# Altium schematic sheet SimPL_IMU_v1_1 _NOV5.SchDoc
size 299 x 236 mm
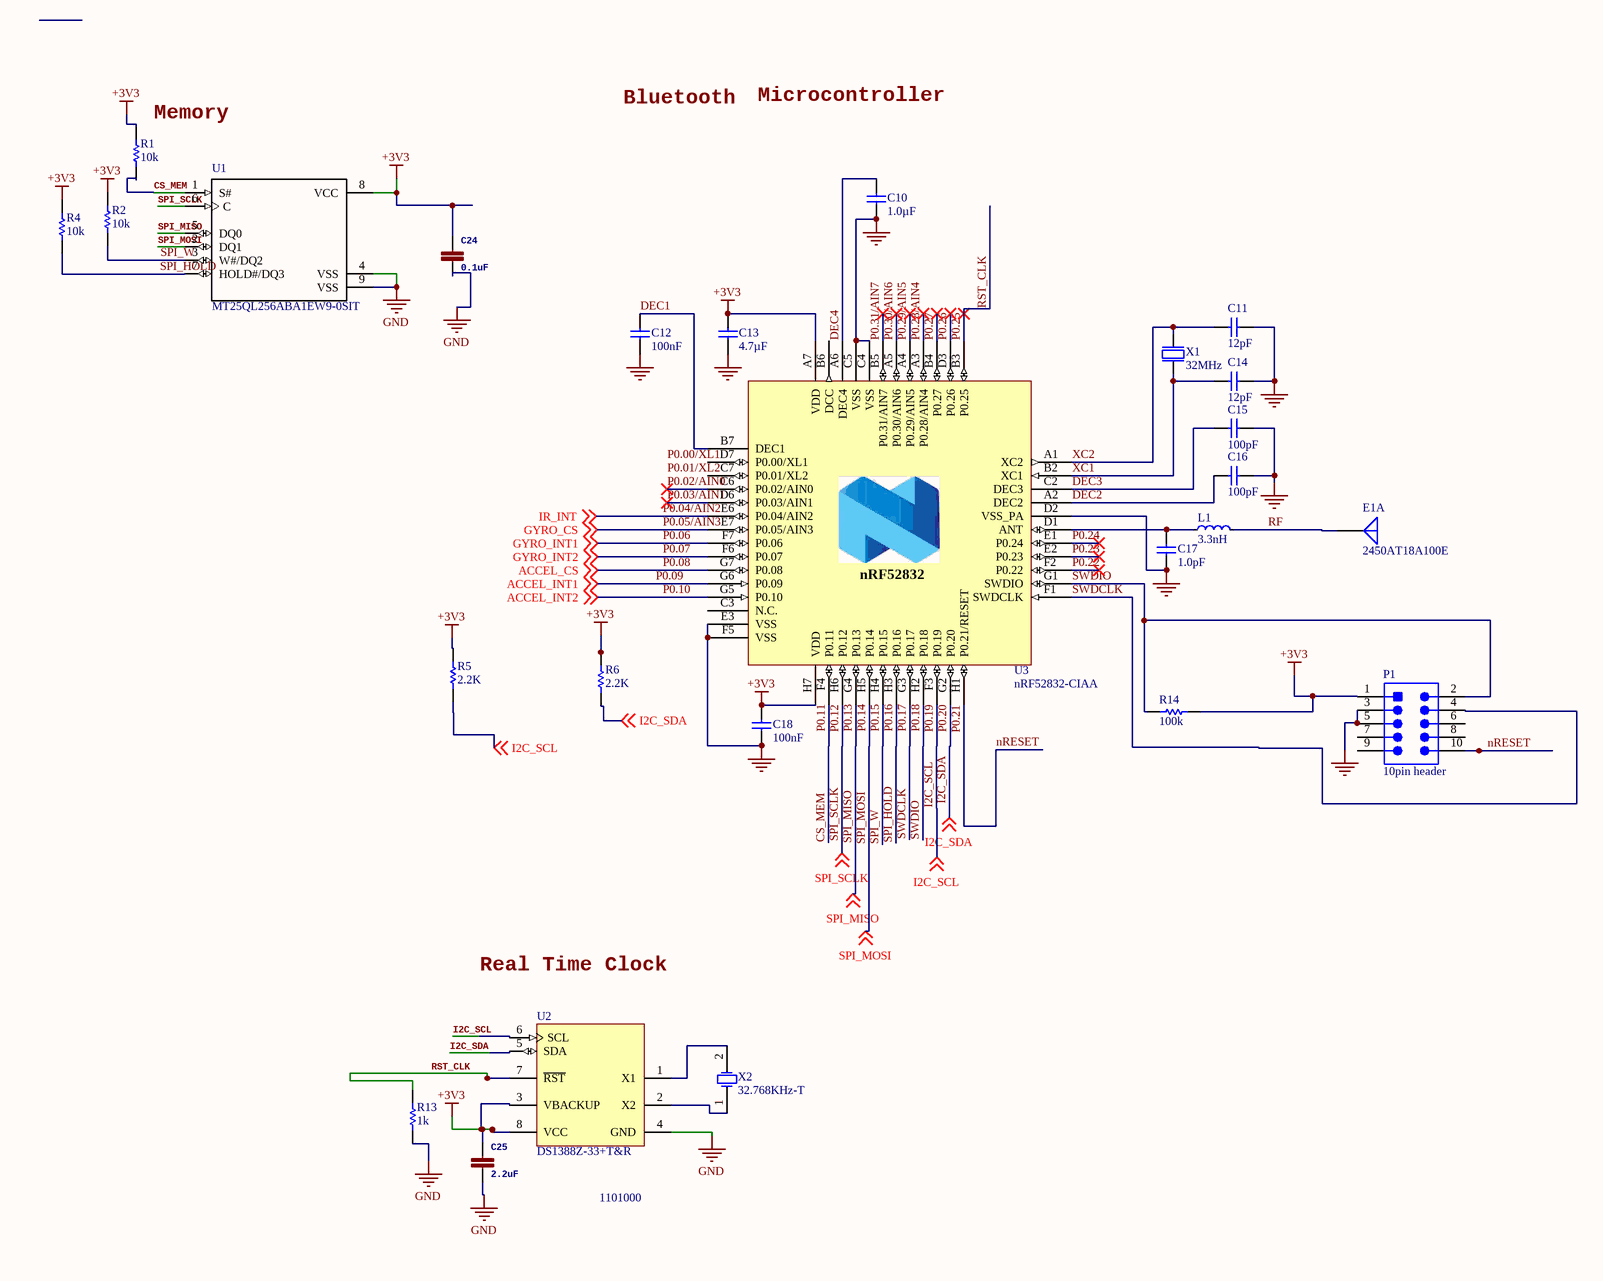
[diagram p0: SimPL_IMU_v1_1 _NOV5.SchDoc]

## Parts
C10  1.0µF  [CAPC1005X04L]
C11  12pF  [CAPC0603X03L]
C12  100nF  [CAPC0603X03L]
C13  4.7µF  [CAPC1608X06L]
C14  12pF  [CAPC0603X03L]
C15  100pF  [CAPC0603X03L]
C16  100pF  [CAPC0603X03L]
C17  1.0pF  [CAPC0603X03L]
C18  100nF  [CAPC0603X03L]
C24  0.1uF  [0402]
C25  2.2uF  [0402]
E1  2450AT18A100E  [JT-2450AT18A100-2_V]  (part A of 2)
L1  3.3nH  [INDC0603X03L]
P1  10pin header  [SMTC-FTSH-105-01-L-DV_V]
R1  10k  [RESC1005X40X25NL05T05]
R2  10k  [RESC1005X40X25NL05T05]
R4  10k  [RESC1005X40X25NL05T05]
R5  2.2K  [RESC1005X40X25ML10T10]
R6  2.2K  [RESC1005X40X25ML10T10]
R13  1k  [RESC1005X40X25NL05T05]
R14  100k  [RESC1005X40X25ML05T05]
U1  MT25QL256ABA1EW9-0SIT  [*SON127P600X800X80-9N]
U2  DS1388Z-33+T&R  [S8+4_M]
U3  nRF52832-CIAA  [BGA50C40P7X8_295X322X50]
X1  32MHz  [BT-XTAL_2016]
X2  32.768KHz-T  [ABRA-ABS07-2_V]

## Nets
+3V3: C13.1 C18.1 C24.1 C25.1 P1.1 R1.2 R2.2 R4.2 R5.2 R6.2 R14.2 U1.8(VCC) U2.3(VBACKUP) U2.8(VCC) U3.A7(VDD) U3.H7(VDD)
GND: C10.1 C11.1 C12.2 C13.2 C14.1 C15.2 C16.1 C17.1 C18.2 C24.2 C25.2 P1.3 P1.5 R13.1 U1.4(VSS) U1.9(VSS) U2.4(GND) U3.C4(VSS) U3.C5(VSS) U3.D2(VSS_PA) U3.E3(VSS) U3.F5(VSS) X1.2(GND) X1.4(GND)
CS_MEM: R1.1 U1.1(S#) U3.F4(P0.11)  [also labelled P0.11]
DEC1: C12.1 U3.B7(DEC1)
DEC2: C16.2 U3.A2(DEC2)
DEC3: C15.1 U3.C2(DEC3)
DEC4: C10.2 U3.A6(DEC4)
I2C_SCL: R5.1 U2.6(SCL) U3.F3(P0.19) ; off-sheet I2C_SCL  [also labelled P0.19]
I2C_SDA: R6.1 U2.5(SDA) U3.G2(P0.20) ; off-sheet I2C_SDA  [also labelled P0.20]
nRESET: P1.10 U3.H1(P0.21/RESET)  [also labelled P0.21]
P0.02/AIN0: U3.C6(P0.02/AIN0)
P0.03/AIN1: U3.D6(P0.03/AIN1)
P0.04/AIN2: U3.E6(P0.04/AIN2) ; off-sheet IR_INT  [also labelled IR_INT]
P0.05/AIN3: U3.E7(P0.05/AIN3) ; off-sheet GYRO_CS  [also labelled GYRO_CS]
P0.06: U3.F7(P0.06) ; off-sheet GYRO_INT1  [also labelled GYRO_INT1]
P0.07: U3.F6(P0.07) ; off-sheet GYRO_INT2  [also labelled GYRO_INT2]
P0.08: U3.G7(P0.08) ; off-sheet ACCEL_CS  [also labelled ACCEL_CS]
P0.09: U3.G6(P0.09) ; off-sheet ACCEL_INT1  [also labelled ACCEL_INT1]
P0.10: U3.G5(P0.10) ; off-sheet ACCEL_INT2  [also labelled ACCEL_INT2]
P0.12: U1.6(C) U3.H6(P0.12) ; off-sheet SPI_SCLK  [also labelled SPI_SCLK]
P0.13: U1.5(DQ0) U3.G4(P0.13) ; off-sheet SPI_MISO  [also labelled SPI_MISO]
P0.14: U1.2(DQ1) U3.H5(P0.14) ; off-sheet SPI_MOSI  [also labelled SPI_MOSI]
P0.15: R2.1 U1.3(W#/DQ2) U3.H4(P0.15)  [also labelled SPI_W]
P0.16: R4.1 U1.7(HOLD#/DQ3) U3.H3(P0.16)  [also labelled SPI_HOLD]
P0.17: P1.4 U3.F1(SWDCLK) U3.G3(P0.17)  [also labelled SWDCLK]
P0.18: P1.2 R14.1 U3.G1(SWDIO) U3.H2(P0.18)  [also labelled SWDIO]
P0.22: U3.F2(P0.22)
P0.23: U3.E2(P0.23)
P0.24: U3.E1(P0.24)
P0.25: R13.2 U2.7(~{RST}) U3.B3(P0.25)  [also labelled RST_CLK]
P0.26: U3.D3(P0.26)
P0.27: U3.B4(P0.27)
P0.28/AIN4: U3.A3(P0.28/AIN4)
P0.29/AIN5: U3.A4(P0.29/AIN5)
P0.30/AIN6: U3.A5(P0.30/AIN6)
P0.31/AIN7: U3.B5(P0.31/AIN7)
RF: E1.1(FP) L1.2
XC1: C14.2 U3.B2(XC1) X1.1(inp)
XC2: C11.2 U3.A1(XC2) X1.3(out)
NetC17_2: C17.2 L1.1 U3.D1(ANT)
NetU2_1: U2.1(X1) X2.2(X2)
NetU2_2: U2.2(X2) X2.1(X2)

Not connected (* = marked no-connect by the designer): P1 6 7 8 9; U3 B6(DCC) C3(N.C.) C7(P0.01/XL2) D7(P0.00/XL1)

## Notes on the sheet
- (near R1) Memory
- Bluetooth
- Microcontroller
- Real Time Clock
- 1101000
- Labels drawn without touching a wire or pin: P0.00/XL1, P0.01/XL2
- (in symbol nRF52832-CIAA) nRF52832

## Library data of the parts
C10 = C0402-1µ0: Capacitor, X5R, ±5%; Note: 6.3V; Artikkelnr Noca: 20039235; Artikkelnr Simpro: N.A.; Part Number: C0402-1µ0; Manufacturer: *; Manufacturer Part Number: *; Datasheet: *; LatestRevisionDate: 2009-11-23; Pin Count: 2; Publisher: Nordic Semiconductor; Published: 2009-05-08; Value: 1.0µF; Supplier: *; Supplier part number: *; 2nd source Supplier: *; 2nd source part number: *; Footprint Doc: 0402
C11 C14 = C0201-12p: Capacitor, NP0, ±2%; Note: 50V; Artikkelnr Noca: N.A.; Part Number: C0201-12p; Manufacturer: *; Manufacturer Part Number: *; Datasheet: *; LatestRevisionDate: 2014-11-13; Pin Count: 2; Publisher: Nordic Semiconductor; Published: 2014-11-13; Value: 12pF; Supplier: *; Supplier part number: *; 2nd source Supplier: *; 2nd source part number: *; Footprint Doc: 0201; Artikkelnr Simpro: N.A.
C12 C18 = C0201-100n: Capacitor, X7R, ±10%; Note: 16V; Artikkelnr Noca: N.A.; Part Number: C0201-100n; Manufacturer: *; Manufacturer Part Number: *; Datasheet: *; LatestRevisionDate: 2014-11-13; Pin Count: 2; Publisher: Nordic Semiconductor; Published: 2014-11-13; Value: 100nF; Supplier: *; Supplier part number: *; 2nd source Supplier: *; 2nd source part number: *; Footprint Doc: 0201; Artikkelnr Simpro: N.A.
C13 = C0603-4µ7: Capacitor, X5R, ±10%; Note: 6.3V; Artikkelnr Noca: 20069060; Artikkelnr Simpro: N.A.; Part Number: C0603-4µ7; Manufacturer: *; Manufacturer Part Number: *; Datasheet: *; LatestRevisionDate: 2009-11-23; Pin Count: 2; Publisher: Nordic Semiconductor; Published: 2009-05-08; Value: 4.7µF; Supplier: *; Supplier part number: *; 2nd source Supplier: *; 2nd source part number: *; Footprint Doc: 0603
C15 C16 = C0201-100p: Capacitor, NP0, ±5%; Note: Chip Cap 1%; Artikkelnr Noca: N.A.; Part Number: C0201-100p; Manufacturer: *; Manufacturer Part Number: *; Datasheet: *; LatestRevisionDate: 2014-11-13; Pin Count: 2; Publisher: Nordic Semiconductor; Published: 2014-11-13; Value: 100pF; Supplier: *; Supplier part number: *; 2nd source Supplier: *; 2nd source part number: *; Footprint Doc: 0201; Artikkelnr Simpro: N.A.
C17 = C0201-1.0p: Capacitor, NP0, ±5%; Note: Chip Cap 1%; Artikkelnr Noca: N.A.; Part Number: C0201-1.0p; Manufacturer: *; Manufacturer Part Number: *; Datasheet: *; LatestRevisionDate: 2014-11-13; Pin Count: 2; Publisher: Nordic Semiconductor; Published: 2014-11-13; Value: 1.0pF; Supplier: *; Supplier part number: *; 2nd source Supplier: *; 2nd source part number: *; Footprint Doc: 0201; Artikkelnr Simpro: N.A.
C24 = 0.1UF-0402-16V-10%: 0.1ÂµF ceramic capacitors    A capacitor is a passive two-terminal electrical component used to store electrical energy temporarily in an electric field.; GateName_1: G$1; SymbolName_1: CAP; PROD_ID: CAP-12416; DeviceName: -0402-16V-10%; LibraryName: SparkFun-Capacitors; DeviceSetName: 0.1UF
C25 = 0.1UF-0402-16V-10%: 0.1ÂµF ceramic capacitors    A capacitor is a passive two-terminal electrical component used to store electrical energy temporarily in an electric field.; GateName_1: G$1; SymbolName_1: CAP; DeviceSetName: 0.1UF; PROD_ID: CAP-12416; DeviceName: -0402-16V-10%; LibraryName: SparkFun-Capacitors
E1 = CMP-2000-05167-1: Ceramic Antenna, 2.45 GHZ, 2 W, -40 to 125 degC, 2-Pin SMD, RoHS, Tape and Reel; Manufacturer: Johanson Technology; Maximum Frequency: 2500MHz; Typical Antenna Gain: 0.5dB; Minimum Frequency: 2400MHz; Manufacturer URL: https://www.johansontechnology.com/; Type: Ceramic; Datasheet Version: Rev. 1.3, 07/2014; Category: Antenna; Package: 2Case18-4; Datasheet URL: http://www.johansontechnology.com/datasheets/antennas/2450AT18A100.pdf
L1 = L0201-3n3: High frequency chip inductor ±5%; Artikkelnr Noca: N.A.; Part Number: L0201-3n3; Manufacturer: *; Manufacturer Part Number: *; Datasheet: *; LatestRevisionDate: 2013-04-10; Pin Count: 2; Publisher: Nordic Semiconductor; Published: 2013-04-10; Value: 3.3nH; Note: High frequency chip inductor ±5%; Supplier: *; Supplier part number: *; 2nd source Supplier: *; 2nd source part number: *; Footprint Doc: 0201; Artikkelnr Simpro: N.A.
P1 = CMP-2000-05354-1: Male Header, Pitch 1.27 mm, 2 x 5 Position, Height 5.96 mm, -55 to 125 degC, RoHS, Bulk; Manufacturer: Samtec; Connector Type: Header,Unshrouded; Pitch: 0.050"(1.27mm); Mating Products: FLE-105-01-G-DV-TR-ND-CONNSKT1.27MM10POSDUALSMDCLP-105-02-G-D-P-TR-ND-CONNRCPT10POSDUAL.05"SMDSFMC-105-L2-S-D-TR-ND-CONN.05"SURFACE10POSSMTSFMH-105-02-L-D-TR-ND-CONNRECEPT10POS.50"SMTFLE-105-01-G-DV-A-ND-CONNSKT1.27MM10POSDUALSMDCLP-105-02-G-D-BE-ND-CONNRCPT10POSDUAL.05"SMDFLE-105-01-G-DV-A-P-ND-CONNSKT1.27MM10POSDUALSMDSAM1153-05-ND-CONNRCPT10POSDUAL.05"SMDSAM1155-05-ND-CONNRCPT10POSDUAL.05"SMDSAM1154-05-ND-CONNRCPT10POSDUAL.05"SMDSFMH-105-02-L-D-LC-ND-CONNRECEPT10POS.50"SMTSAM1226-05-ND-CONNRCPT.05"10POSDUALSMD; Catalog Drawings: FTSHSeriesFTSHSeriesSMTSide; Other Names: SAM1161-05; EDA / CAD Models: DownloadfromAcceleratedDesigns; Number of Positions Loaded: All; Number of Positions: 10; Featured Product: Board-To-BoardInterconnectSystems; Online Catalog: FTSHSeries; Product Training Modules: Board-to-BoardConnectors; Category: Connectors,Interconnects; Number of Rows: 2; Contact Finish: Gold; Termination: Solder; Mounting Type: SurfaceMount; Series: FTSH; Contact Mating Length: 0.120"(3.05mm); Row Spacing: 0.050"(1.27mm); Datasheet URL: https://datasheet.ciiva.com/30493/0900766b80adfe36-30493006.pdf; Contact Finish Thickness: 10µin(0.25µm); Features: -; Standard Package: 1; Packaging: Bulk; Datasheet Version: Feb-08; Manufacturer URL: http://www.samtec.com/; Fastening Type: -; Family: RectangularConnectors-Headers,MalePins; Contact Type: MalePin; Color: Black
R1 R2 R4 = CMP-2002-00607-3: Chip Resistor, 10 KOhm, +/- 1%, 100 mW, -55 to 155 degC, 0402 (1005 Metric), RoHS, Tape and Reel; Manufacturer: Basic Passives; PartNumber: ERJ-2RKF1002X; Case\/Package: 0402; Resistance: 10 KOhm; Voltage Rating: 50 V; Power Rating: 100 mW; Packaging: Tape and Reel; Width: 0.5 mm; Package Quantity: 10000; Radiation Hardening: No; Min Operating Temperature: -55 degC; Case Code (Imperial): 0402; REACH SVHC: Yes; PackageDescription: 2-Pin Surface Mount Device, Body 1 x 0.5 mm; Length: 1 mm; ComponentLink1Description: Manufacturer URL; PackageReference: 0402; RoHSCompliant: true; ComponentLink1URL: http://www.panasonic.com/; Height: 0.35 mm; ComponentLink2Description: Datasheet; DatasheetVersion: 04/2015; Mounting Technology: Surface Mount; ComponentLink2URL: http://industrial.panasonic.com/cdbs/www-data/pdf/RDA0000/AOA0000C86.pdf; Max Operating Temperature: 155 degC; Pins: 2; Tolerance: 1%; Case Code (Metric): 1005; Mount: Surface Mount
R5 R6 = CMP-2002-06097-1: Part Number: MC00625W040212K2; Manufacturer: Multicomp
R13 = CMP-2002-08276-1: Manufacturer: Vishay Dale; Part Number: CRCW04021K00FKED
R14 = CMP-2002-08123-2: Chip Resistor, 100 KOhm, +/- 1%, 0.63 W, -55 to 155 degC, 0402 (1005 Metric), RoHS, Tape and Reel; Voltage Rating: 50 V; Type (Resistor): Thick Film; Power Rating: 63 mW; Case\Package: 0402; Mount: Surface Mount; Packaging: Tape and Reel; Weight: 2.3E-05 oz; PackageDescription: 2-Pin Surface Mount Device, Body 1 x 0.5 mm; ComponentLink1Description: Manufacturer URL; ComponentLink2Description: Datasheet; Min Operating Temperature: -55 degC; Width: 0.5 mm; Resistance: 100 kohm; REACH SVHC: Unknown; ComponentLink2URL: http://www.vishay.com/docs/20035/dcrcwe3.pdf; Package Quantity: 10000; Mounting Technology: Surface Mount; PackageReference: 0402; ComponentLink1URL: http://www.vishay.com/; Max Operating Temperature: 155 degC; Length: 1 mm; DatasheetVersion: 06/2012; Height: 0.35 mm; Case Code (Imperial): 0402; Pins: 2; Tolerance: 1%; Case Code (Metric): 1005; Radiation Hardening: No; RoHSCompliant: true
U1 = MT25QL256ABA1EW9-0SIT: NOR Flash Serial-SPI 3.3V 256Mbit 256M x 1bit 8-Pin WPDFN; MF: Micron Technology; SnapEDA_Link: https://www.snapeda.com/parts/MT25QL256ABA1EW9-0SIT/Micron%20Technology%20Inc./view-part/?ref=snap; Availability: Unavailable; Price: None; MP: MT25QL256ABA1EW9-0SIT; Package: WDFN-8 Micron Technology; Value: *
U2 = CMP-0254-00385-1: I2C Real-Time Clock/Supervisor with Trickle Charger and 512 Byte EEPROM, 3.3V, 8-Pin SO, -40 to 85 degC, Pb-Free, Reel; Code_IPC: SOIC127P600-8; ComponentLink3URL: http://pdfserv.maxim-ic.com/package_dwgs/21-0041.PDF; ComponentLink1URL: http://www.maxim-ic.com; ComponentLink2Description: Datasheet; PackageVersion: revC, 2010; ComponentLink1Description: Manufacturer URL; DatasheetVersion: rev3, Aug-2010; PackageReference: S8+4; ComponentLink2URL: http://datasheets.maxim-ic.com/en/ds/DS1388.pdf; PackageDescription: 8-Pin Small-Outline IC, Narrow (0.15in), 1.27 mm Pitch, SOIC (N), Pb-Free; Code_JEDEC: MS-012-AA; ComponentLink3Description: Package Specification
U3 = nRF52832-CIAA: Multi-protocol Bluetooth Low Energy, ANT and 2.4GHz proprietary system-on-chip; Manufacturer: Nordic Semiconductor; Artikkelnr Noca: N.A.; Part Number: nRF52832-CIAA; Manufacturer Part Number: nRF52832-CIAA; Datasheet: *; LatestRevisionDate: 2016-03-11; Pin Count: 54; Publisher: Nordic Semiconductor; Published: 2016-03-11; Value: nRF52832-CIAA; Note: *; Supplier: Nordic Semiconductor; Supplier part number: *; 2nd source Supplier: *; 2nd source part number: *; Footprint Doc: WLCSP_C50; Artikkelnr Simpro: N.A.; Part number IPS: N.A.
X1 = XTAL_SMD2016_32MHz_8pF_Epson: XTAL SMD 2016, 32MHz, Cl=8pF, Total Tol: ±40ppm; Manufacturer: Epson Toyocom; Manufacturer Part Number: Q22FA12800025; Note: XTAL SMD 32.000MHz; Artikkelnr Noca: N.A.; Part Number: XTAL_SMD2016_32MHz_8pF_Epson; Datasheet: http://www.epsondevice.com/docs/qd/en/DownloadServlet?id=ID000449; LatestRevisionDate: 2014-11-27; Pin Count: 4; Publisher: Nordic Semiconductor; Published: 2012-03-09; Value: 32MHz; Supplier: Farnell; Supplier part number: 171-2806; 2nd source Supplier: *; 2nd source part number: *; Footprint Doc: XTAL_2016; Artikkelnr Simpro: N.A.
X2 = CMP-0447-00001-2: Crystal, 32.768 kHz, 12.5 pF, -40 to 85 degC, SMD Low Profile 3.2 x 1.5 x 0.9 mm, Tape and Reel; Manufacturer: Abracon; PartNumber: ABS07-32.768KHz-T; Q Value (Type): 30000; Operation Mode: Flexural Mode (Tuning Fork); Shunt Capacitance (C0): 0.9 to 1.2 pF; Load Capacitance (CL): 12.5 pF; Frequency Tolerance @+25degC: +/- 20 ppm; Drive Level (Type): 0.1 uW; Equivalent Series Resistance (R1): 70 Kohm; Insulation Resistance (Min): 500 Mohm; ComponentLink3URL: http://www.abracon.com/Resonators/ABS07.pdf; PackageDescription: 2-Pin Hand Drawn, Body 3.2x1.5mm, Pitch 2.5mm; Operating Temperature: -40 to 85 degC; ComponentLink2URL: http://www.abracon.com/Resonators/ABS07.pdf; PackageReference: ABS07-2; ComponentLink3Description: Package Specification; ComponentLink1Description: Manufacturer URL; DatasheetVersion: 04.03.13; Mounting Technology: Surface Mount; ComponentLink2Description: Datasheet; ComponentLink1URL: http://www.abracon.com/; Packing: Tape and Reel; Frequency: 32.768 kHz